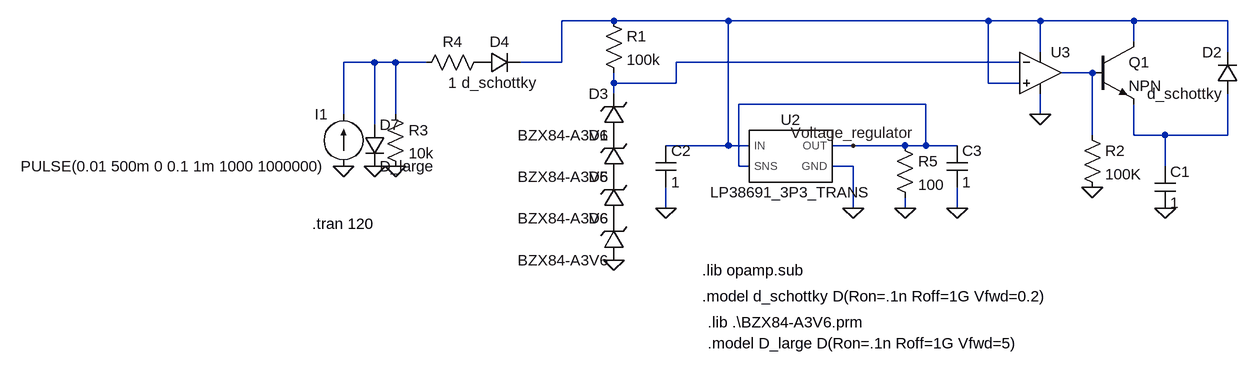
[diagram p0: schematic sim1 saved plot.asc]
sim1 saved plot.asc, the LTspice schematic file:
Version 4
SHEET 1 880 680
WIRE -96 -16 -176 -16
WIRE 80 -16 -96 -16
WIRE 480 -16 80 -16
WIRE 560 -16 480 -16
WIRE 704 -16 560 -16
WIRE 848 -16 704 -16
WIRE 704 16 704 -16
WIRE 560 32 560 -16
WIRE 848 32 848 -16
WIRE -464 48 -512 48
WIRE -432 48 -464 48
WIRE -384 48 -432 48
WIRE -176 48 -176 -16
WIRE -176 48 -240 48
WIRE 528 48 0 48
WIRE 640 64 592 64
WIRE -96 80 -96 64
WIRE 0 80 0 48
WIRE 0 80 -96 80
WIRE 480 80 480 -16
WIRE 528 80 480 80
WIRE -96 96 -96 80
WIRE 384 112 96 112
WIRE -512 128 -512 48
WIRE -432 128 -432 48
WIRE 560 128 560 96
WIRE -464 144 -464 48
WIRE 640 160 640 64
WIRE 704 160 704 112
WIRE 752 160 704 160
WIRE 848 160 848 96
WIRE 848 160 752 160
WIRE 80 176 80 -16
WIRE 80 176 -16 176
WIRE 112 176 80 176
WIRE 272 176 240 176
WIRE 352 176 272 176
WIRE 384 176 384 112
WIRE 384 176 352 176
WIRE 432 176 384 176
WIRE 96 208 96 112
WIRE 112 208 96 208
WIRE 272 208 240 208
WIRE 752 208 752 160
WIRE -16 272 -16 240
WIRE 272 272 272 208
WIRE 352 272 352 256
WIRE 432 272 432 240
FLAG -512 208 0
FLAG 752 272 0
FLAG -16 272 0
FLAG 432 272 0
FLAG 272 272 0
FLAG 640 240 0
FLAG -432 208 0
FLAG 560 128 0
FLAG 352 272 0
FLAG -96 352 0
FLAG -464 208 0
FLAG 272 176 Voltage_regulator
SYMBOL current -512 208 R180
WINDOW 0 24 80 Left 2
WINDOW 3 24 0 Left 2
WINDOW 123 0 0 Left 2
WINDOW 39 0 0 Left 2
SYMATTR InstName I1
SYMATTR Value PULSE(0.01 500m 0 0.1 1m 1000 1000000)
SYMBOL diode 864 96 R180
WINDOW 0 24 64 Left 2
WINDOW 3 24 0 Left 2
SYMATTR InstName D2
SYMATTR Value d_schottky
SYMBOL cap 736 208 R0
SYMATTR InstName C1
SYMATTR Value 1
SYMBOL npn 640 16 R0
SYMATTR InstName Q1
SYMBOL zener -80 160 R180
WINDOW 0 24 64 Left 2
WINDOW 3 24 0 Left 2
SYMATTR InstName D3
SYMATTR Value BZX84-A3V6
SYMBOL res -112 -32 R0
SYMATTR InstName R1
SYMATTR Value 100k
SYMBOL cap -32 176 R0
SYMATTR InstName C2
SYMATTR Value 1
SYMBOL cap 416 176 R0
SYMATTR InstName C3
SYMATTR Value 1
SYMBOL LP38691_3P3_TRANS 176 192 R0
SYMATTR InstName U2
SYMBOL diode -304 64 R270
WINDOW 0 32 32 VTop 2
WINDOW 3 0 32 VBottom 2
SYMATTR InstName D4
SYMATTR Value d_schottky
SYMBOL res 624 144 R0
SYMATTR InstName R2
SYMATTR Value 100K
SYMBOL res -448 112 R0
SYMATTR InstName R3
SYMATTR Value 10k
SYMBOL res -288 32 R90
WINDOW 0 0 56 VBottom 2
WINDOW 3 32 56 VTop 2
SYMATTR InstName R4
SYMATTR Value 1
SYMBOL Opamps\\UniversalOpamp2 560 64 R0
SYMATTR InstName U3
SYMBOL res 336 160 R0
SYMATTR InstName R5
SYMATTR Value 100
SYMBOL zener -80 224 R180
WINDOW 0 24 64 Left 2
WINDOW 3 24 0 Left 2
SYMATTR InstName D1
SYMATTR Value BZX84-A3V6
SYMBOL zener -80 288 R180
WINDOW 0 24 64 Left 2
WINDOW 3 24 0 Left 2
SYMATTR InstName D5
SYMATTR Value BZX84-A3V6
SYMBOL zener -80 352 R180
WINDOW 0 24 64 Left 2
WINDOW 3 24 0 Left 2
SYMATTR InstName D6
SYMATTR Value BZX84-A3V6
SYMBOL diode -480 144 R0
SYMATTR InstName D7
SYMATTR Value D_large
TEXT -560 296 Left 2 !.tran 120
TEXT 40 368 Left 2 !.lib opamp.sub
TEXT 40 408 Left 2 !.model d_schottky D(Ron=.1n Roff=1G Vfwd=0.2)
TEXT 48 448 Left 2 !.lib .\\BZX84-A3V6.prm
TEXT 48 480 Left 2 !.model D_large D(Ron=.1n Roff=1G Vfwd=5)

The netlist it stands for:
* sim1 saved plot.asc
I1 0 N002 PULSE(0.01 500m 0 0.1 1m 1000 1000000)
D2 N005 N001 d_schottky
C1 N005 0 1
Q1 N001 N004 N005 0 NPN
D3 P001 N003 BZX84-A3V6
R1 N001 N003 100k
C2 N001 0 1
C3 Voltage_regulator 0 1
XU2 N001 Voltage_regulator Voltage_regulator 0 LP38691_3P3_TRANS  ; pins IN SNS OUT GND
D4 P002 N001 d_schottky
R2 N004 0 100K
R3 N002 0 10k
R4 P002 N002 1
XU3 N001 N003 N001 0 N004 level.2 Avol=1Meg GBW=10Meg Slew=10Meg ilimit=25m rail=0 Vos=0 phimargin=45 en=0 enk=0 in=0 ink=0 Rin=500Meg  ; pins IN+ IN- V+ V- OUT
R5 Voltage_regulator 0 100
D1 P003 P001 BZX84-A3V6
D5 P004 P003 BZX84-A3V6
D6 0 P004 BZX84-A3V6
D7 N002 0 D_large
.model D D
.lib standard.dio
.model NPN NPN
.model PNP PNP
.lib standard.bjt
.tran 120
.lib opamp.sub
.model d_schottky D(Ron=.1n Roff=1G Vfwd=0.2)
.lib .\BZX84-A3V6.prm
.model D_large D(Ron=.1n Roff=1G Vfwd=5)
.lib .\lp38691_3p3_trans.lib
.lib UniversalOpamps2.sub
.backanno
.end